# EAGLE design turbidityLED (EAGLE 8.7.1)
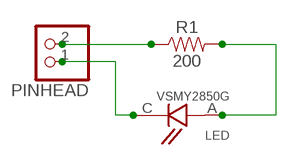
[diagram p0: schematic, sheet 1]

## Parts
LED  VSMY2850G  [SOD4223X279N]
PINHEAD  PINHD-1X2  [1X02]
R1  200  200OHM-0603-1/10W-1%  [0603]

## Nets
N$1: PINHEAD.2 R1.1
N$4: LED.A R1.2
N$5: LED.C PINHEAD.1

## Library data of the parts
LED = VSMY2850G:VSMY2850G: 850 nm 100 mA ±10° Surface Mount High Speed Infrared Emitting Diode; AVAILABILITY: Good; DESCRIPTION: 850 nm 100 mA ±10° Surface Mount High Speed Infrared Emitting Diode; MF: Vishay Semiconductor; MP: VSMY2850G; PACKAGE: SMD-2 Vishay; PRICE: 0.52 USD
PINHEAD = pinhead:PINHD-1X2: PIN HEADER
R1 = SparkFun-Resistors:200OHM: 200Ω resistor A resistor is a passive two-terminal electrical component that implements electrical resistance as a circuit element. Resistors act to reduce current flow, and, at the same time, act to lower voltage levels within circuits. - Wikipedia; PROD_ID: RES-08220

## Board
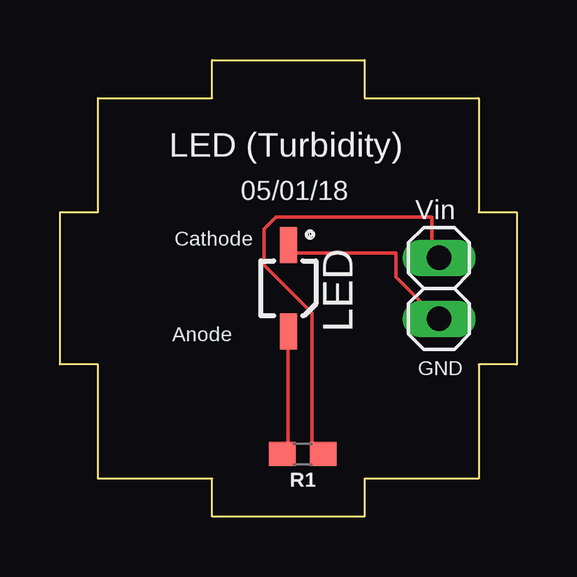
[diagram p1: board, top side]

Size 19.05 x 19.05 mm. Coordinates in mm from the lower left corner, seen from the top.
Outline: 1.59,1.59 1.59,6.35 0,6.35 0,12.7 1.59,12.7 1.59,17.46 6.35,17.46 6.35,19.05 12.7,19.05 12.7,17.46 17.46,17.46 17.46,12.7 19.05,12.7 19.05,6.35 17.46,6.35 17.46,1.59 12.7,1.59 12.7,0 6.35,0 6.35,1.59 1.59,1.59
Copper layers (1*16): Top 0.035mm / dielectric 1.5mm / Bottom 0.035mm
Design rules: minimum track width 6mil, minimum drill 0.35mm, track to track 6mil, track to pad 6mil, pad to pad 6mil, via to via 6mil, smd to smd 6mil, copper to edge 40mil, drill to drill 6mil, minimum pad ring 10mil, minimum via ring 8mil, stop-mask expansion 4mil, vias tented up to drill 0mil, thermal gap 10mil

### Footprints (pad centres in the part's own frame; a part is rotated, then mirrored left to right if it is on the bottom)
SOD4223X279N = smd 1.5 x 0.7: A 1.8,0; C -1.8,0
1X02 = drill 1.016 long: 1 -1.27,0; 2 1.27,0
0603 = smd 1.1 x 1: 1 -0.85,0; 2 0.85,0

### Placement (x,y rotation side)
LED  9.53,9.53 270 top
PINHEAD  15.8,9.53 90 top
R1  10.12,2.62 180 top

### Tracks (layer width: path | path; a pad name or v marks a point on that pad's centre or on a via)
N$1
  Top 0.152: R1.1 10.5,3 10.5,8.5 8.5,10.5 8.5,12 9,12.5 15.5,12.5 15.5,11 PINHEAD.2
N$4
  Top 0.152: R1.2 9.5,3 9.5,7.5 LED.A
N$5
  Top 0.152: LED.C 9.5,11 14,11 14,10 15.5,8.5 PINHEAD.1

### Text on the board
tPlace: LED (Turbidity) | 05/01/18 | Vin | Cathode | Anode | GND